# EAGLE design Uno (EAGLE 6.5.0)
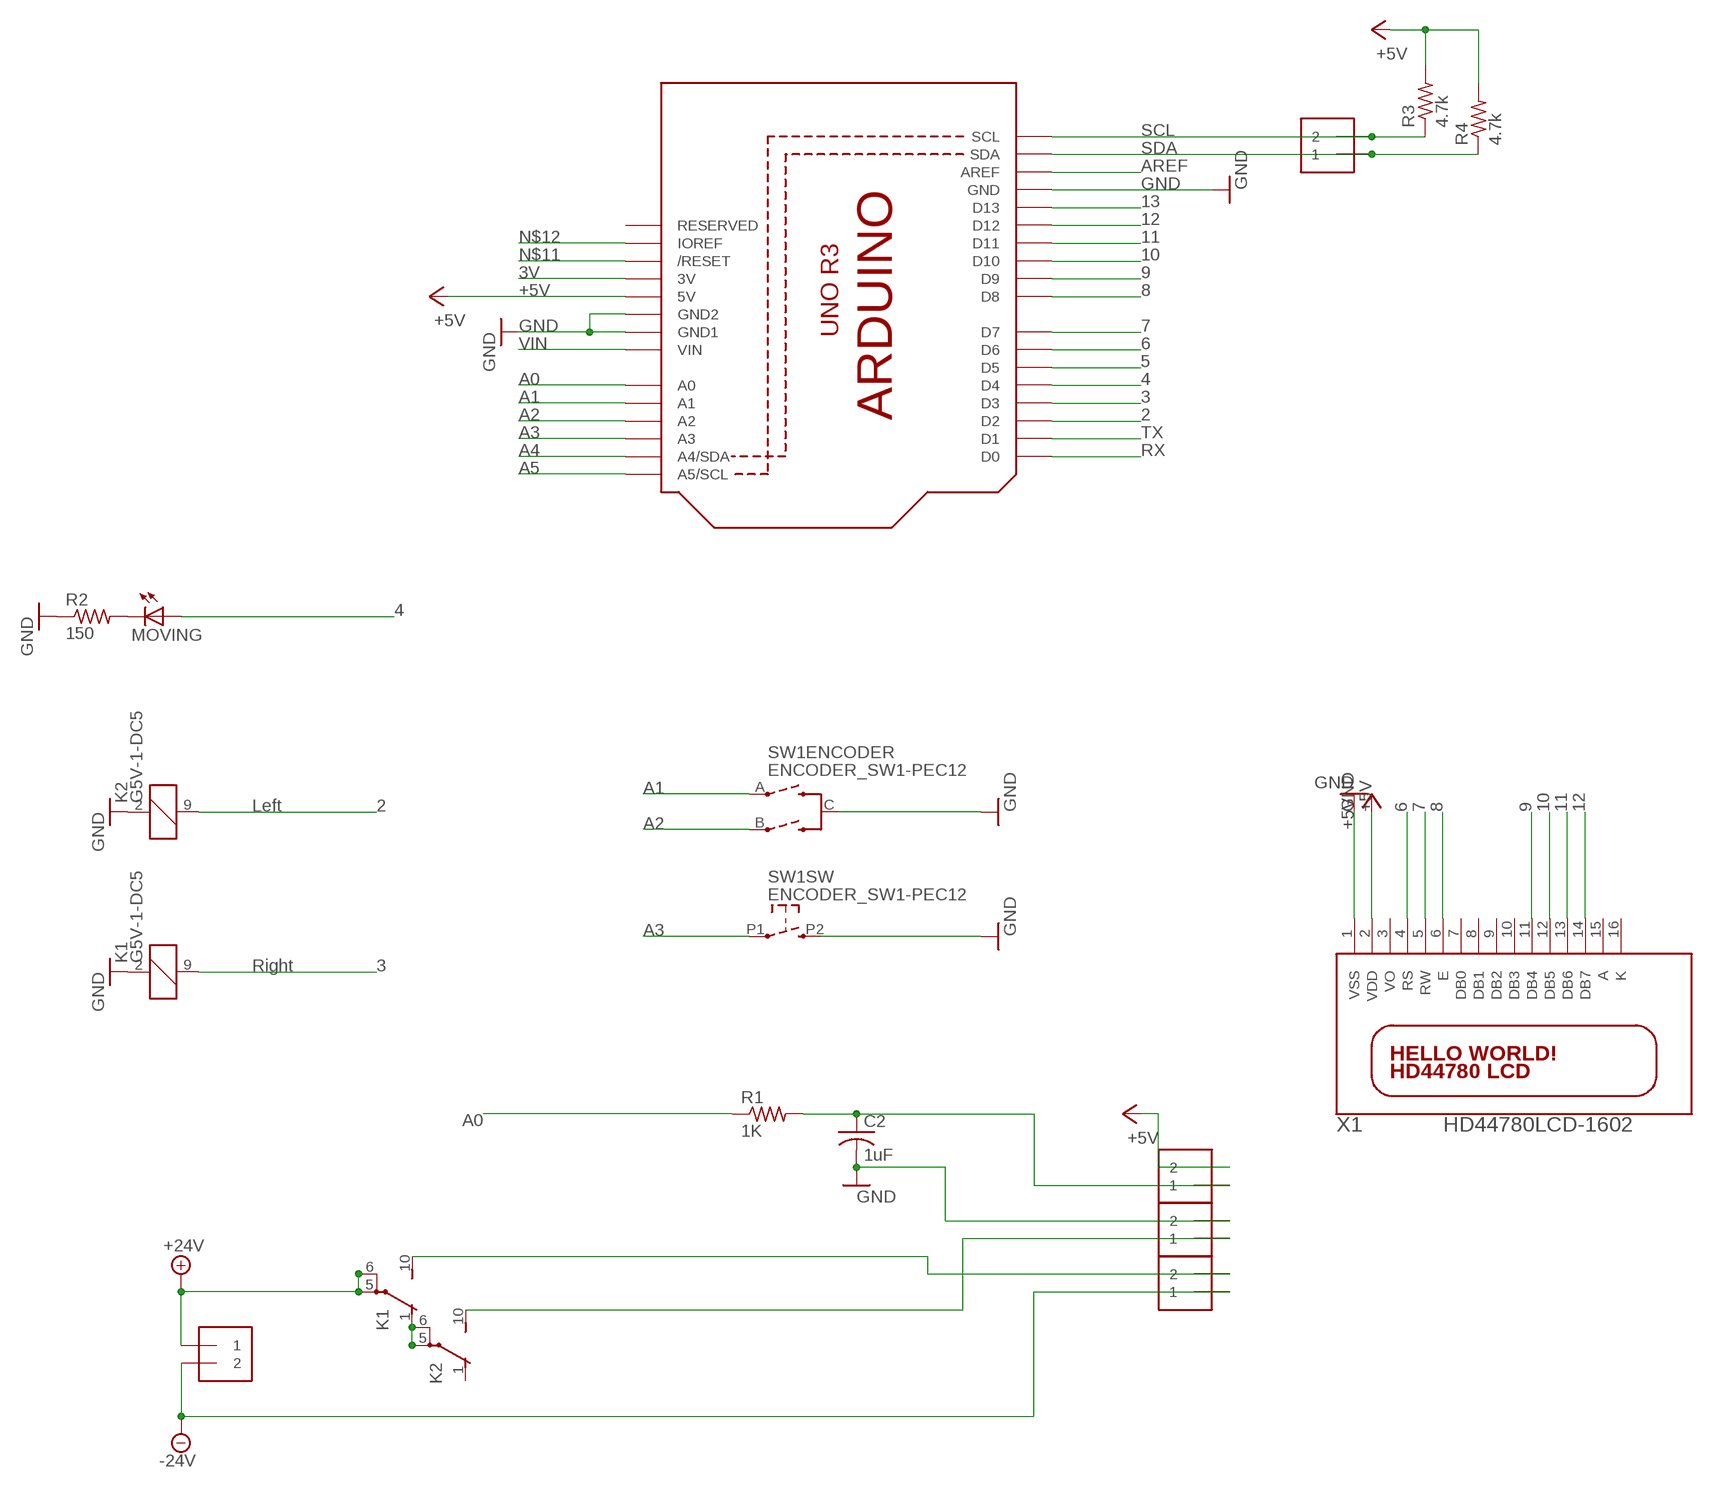
[diagram p0: schematic, sheet 1]

## Parts
C2  1uF  C-US050-024X044  [C050-024X044]
J1  1X2-3.5MM  [1X2-3.5MM]
J2  1X2-3.5MM  [1X2-3.5MM]
J3  1X2-3.5MM  [1X2-3.5MM]
J4  1X2-3.5MM  [1X2-3.5MM]
J5  1X2-3.5MM  [1X2-3.5MM]
K1  G5V-1-DC5  G5V1  [G5V1]
K2  G5V-1-DC5  G5V1  [G5V1]
MOVING  LED5MM  [LED5MM]
R1  1K  R-US_0414/5V  [0414V]
R2  150  R-US_0207/5V  [0207/5V]
R3  4.7k  R-US_0207/5V  [0207/5V]
R4  4.7k  R-US_0207/5V  [0207/5V]
SW1  ENCODER_SW1-PEC12  [PEC12_INCREMENTAL_ENCODER]
U1  ARDUINOR3-BPLACE  [ARDUINOR3-BPLACE]
X1  HD44780LCD-1602  [LCD1602]

## Nets
2: K2.9 U1.D2
3: K1.9 U1.D3
3V: U1.3V
4: MOVING.A U1.D4
5: U1.D5
6: U1.D6 X1.4(RS)
7: U1.D7 X1.5(RW)
8: U1.D8 X1.6(E)
9: U1.D9 X1.11(DB4)
10: U1.D10 X1.12(DB5)
11: U1.D11 X1.13(DB6)
12: U1.D12 X1.14(DB7)
13: U1.D13
+5V [Power]: J5.2 R3.2 R4.2 U1.5V X1.2(VDD)
+24V [Power]: J2.1 K1.5(2:P) K1.6(2:P)
-24V [Power]: J2.2 J3.1
A0: R1.1 U1.A0
A1: SW1.A(ENCODER:A) U1.A1
A2: SW1.B(ENCODER:B) U1.A2
A3: SW1.P1 U1.A3
A4: U1.A4(A4/SDA)
A5: U1.A5(A5/SCL)
AREF: U1.AREF
GND [Power]: C2.2 J4.2 K1.2 K2.2 R2.1 SW1.C(ENCODER:C) SW1.P2 U1.GND U1.GND1 U1.GND2 X1.1(VSS)
N$1: MOVING.K(C) R2.2
N$2 [Power]: K1.1(2:O) K2.5(2:P) K2.6(2:P)
N$3 [Power]: J3.2 K1.10(2:S)
N$5 [Power]: J4.1 K2.10(2:S)
N$8: C2.1 J5.1 R1.2
N$11: U1.RESET(/RESET)
N$12: U1.IOREF
RX: U1.D0
SCL: J1.2 R3.1 U1.SCL
SDA: J1.1 R4.1 U1.SDA
TX: U1.D1
VIN: U1.VIN
Unconnected: K2.1(2:O) U1.RESERVED X1.3(VO) X1.7(DB0) X1.8(DB1) X1.9(DB2) X1.10(DB3) X1.15(A) X1.16(K)

## Notes on the sheet
- Left
- Right

## Library data of the parts
C2 = adafruit:C-US: CAPACITOR, American symbol
J1-J5 = adafruit:1X2: 3.5mm Terminal block http://www.ladyada.net/library/pcb/eaglelibrary.html
K1 K2 = relay:G5V1: RELAY 1 x switch, 0.5 A/125 V AC, 1 A/24 V DC , Omron; MPN: G5V-1-DC24; OC_FARNELL: 9949593; OC_NEWARK: 36M6377
MOVING = adafruit:LED: LED OSRAM: - CHIPLED LG R971, LG N971, LY N971, LG Q971, LY Q971, LO R971, LY R971 LH N974, LH R974 LS Q976, LO Q976, LY Q976 LO Q996 - Hyper CHIPLED LW Q18S LB Q993, LB Q99A, LB R99A - SideLED LS A670, LO A670, LY A670, LG A670, LP A670 LB A673, LV A673, LT A673, LW A673 LH A674 LY A675 LS A676, LA A676, LO A676, LY A676, LW A676 LS A679, LY A679, LG A679 - Hyper Micro SIDELED® LS Y876, LA Y876, LO Y876, LY Y876 LT Y87S - SmartLED LW L88C, LW L88S LB L89C, LB L89S, LG L890 LS L89K, LO L89K, LY L89K LS L896, LA L896, LO L896, LY L896 - TOPLED LS T670, LO T670, LY T670, LG T670, LP T670 LSG T670, LSP T670, LSY T670, LOP T670, LYG T670 LG T671, LOG T671, LSG T671 LB T673, LV T673, LT T673, LW T673 LH T674 LS T676, LA T676, LO T676, LY T676, LB T676, LH T676, LSB T676, LW T676 LB T67C, LV T67C, LT T67C, LS T67K, LO T67K, LY T67K, LW E67C LS E67B, LA E67B, LO E67B, LY E67B, LB E67C, LV E67C, LT E67C LW T67C LS T679, LY T679, LG T679 LS T770, LO T770, LY T770, LG T770, LP T770 LB T773, LV T773, LT T773, LW T773 LH T774 LS E675, LA E675, LY E675, LS T675 LS T776, LA T776, LO T776, LY T776, LB T776 LHGB T686 LT T68C, LB T68C - Hyper Mini TOPLED® LB M676 - Mini TOPLED Santana® LG M470 LS M47K, LO M47K, LY M47K Source: http://www.osram.convergy.de/
R1-R4 = adafruit:R-US_: RESISTOR, American symbol
SW1 = dp_devices:ENCODER_SW1: Incremental Encoder with push switch
U1 = adafruitedit:ARDUINOR3: This is a new object for the new Arduino R3 - with extra pins that you may want to use (such as IOref, and duplicated A4/A5
X1 = adafruitedit:HD44780LCD: HD44780 LCD Standard character type LCDs, available in sizes from 8x1 to 40x4!

## Net classes
0 default: width 0.203 mm, drill 0.33 mm, clearance 0.152 mm
2 Power: width 0.61 mm, drill 0.33 mm, clearance 0.152 mm
4 24V Power: width 1.016 mm, drill 0.33 mm, clearance 0.305 mm

## Board
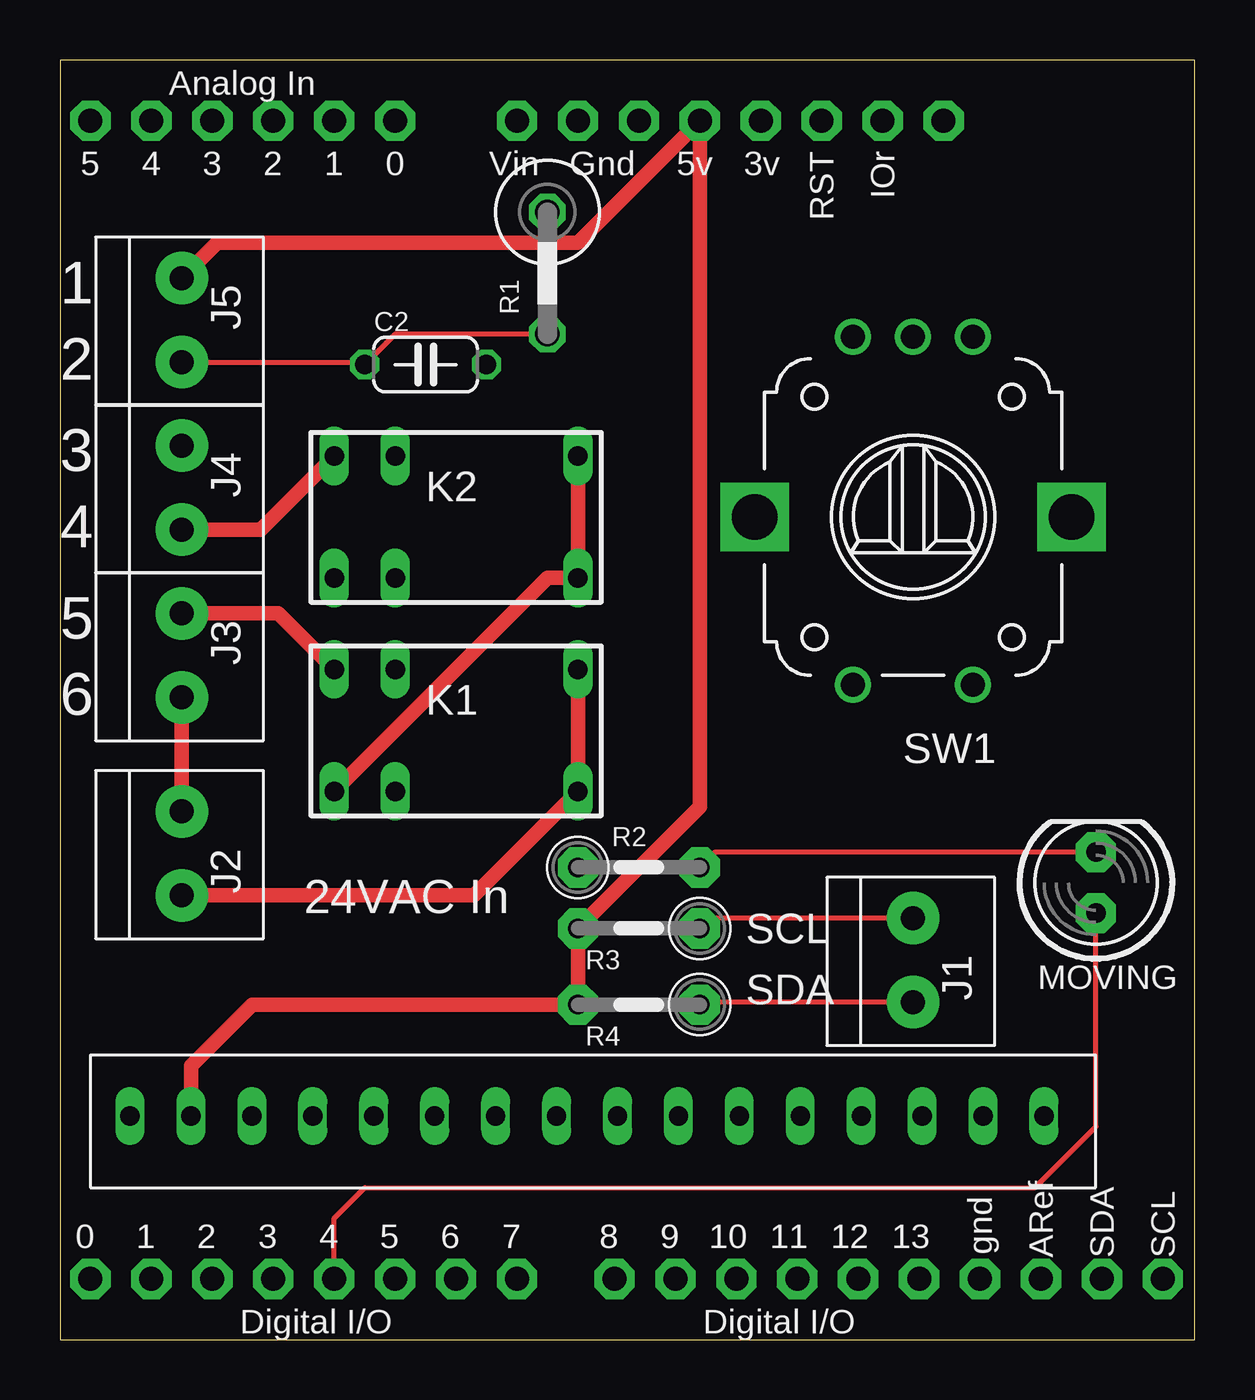
[diagram p1: board, top side]
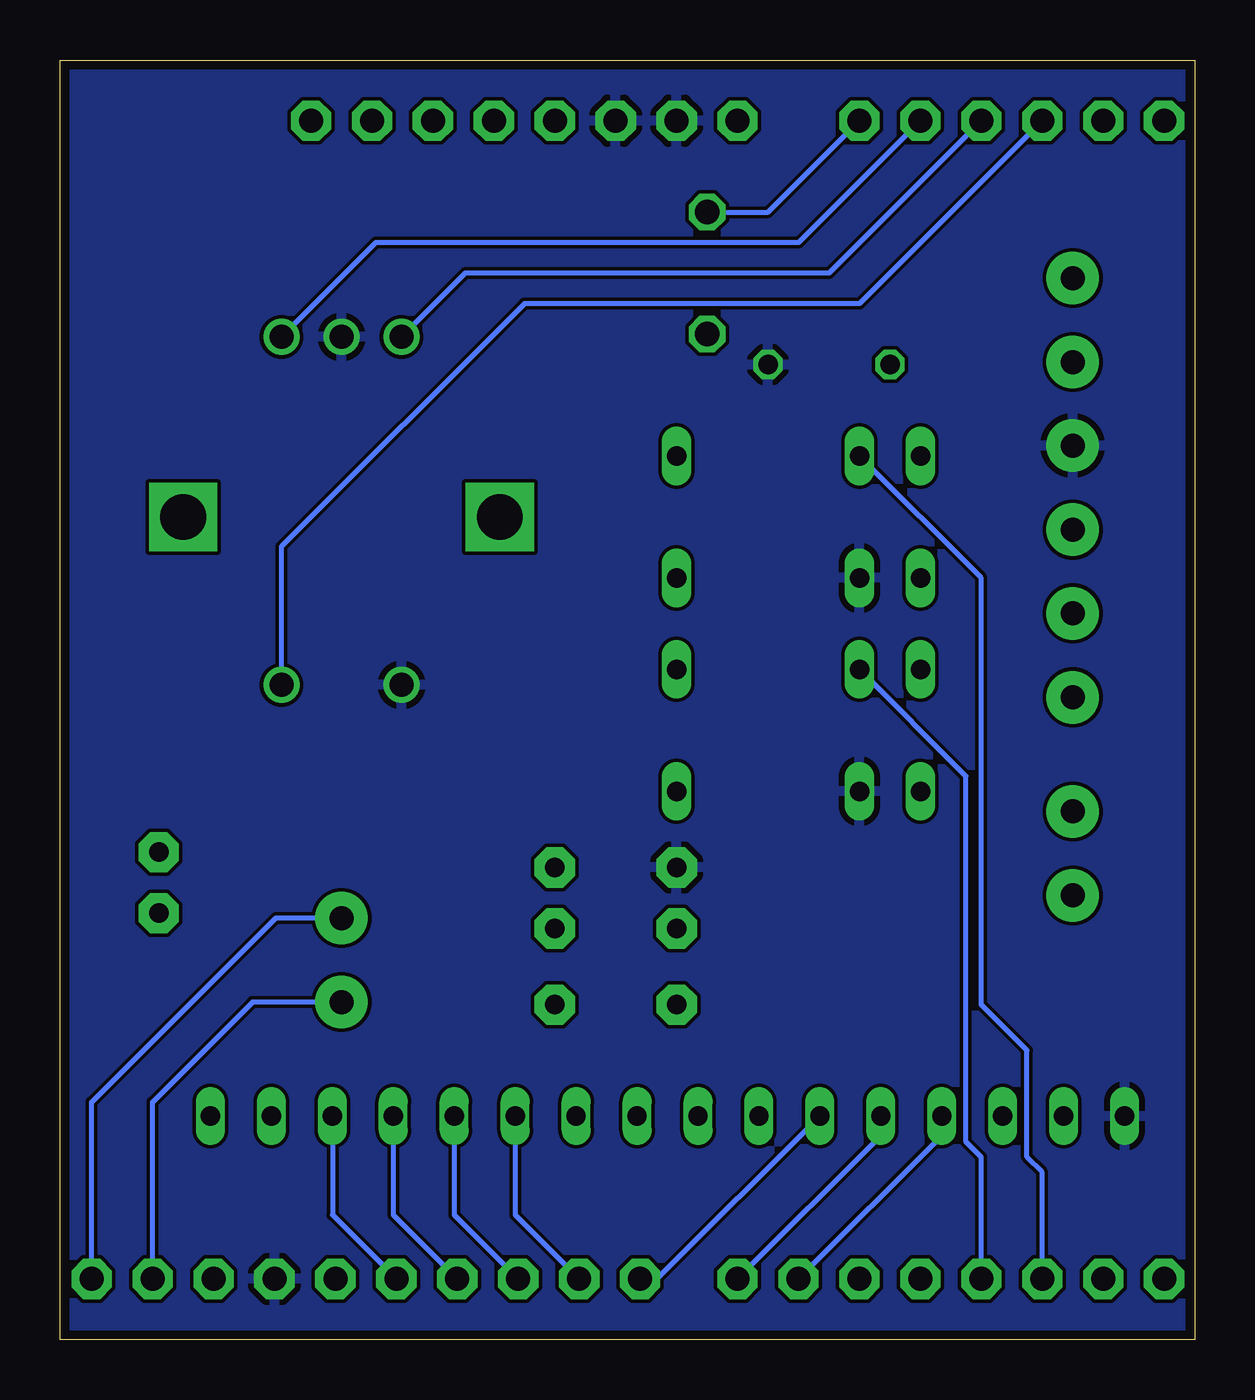
[diagram p2: board, bottom side, seen from below]

Size 47.3 x 53.33 mm. Coordinates in mm from the lower left corner, seen from the top.
Outline: 0,0 47.3,0 47.3,53.33 0,53.33 0,0
Copper layers (1*16): Top 0.0356mm / dielectric 1.5011mm / Bottom 0.0356mm
Design rules "LaenPCBOrder": minimum track width 6mil, minimum drill 13mil, track to track 6mil, track to pad 6mil, pad to pad 6mil, via to via 6mil, smd to smd 6mil, copper to edge 15mil, drill to drill 6mil, minimum pad ring 7mil, minimum via ring 7mil, stop-mask expansion 4mil, vias tented up to drill 0mil, thermal gap 10mil

### Footprints (pad centres in the part's own frame; a part is rotated, then mirrored left to right if it is on the bottom)
C050-024X044 = drill 0.813 octagon: 1 -2.54,0; 2 2.54,0
1X2-3.5MM = drill 1 pad 2.184: 1 1.8,0; 2 -1.7,0
G5V1 = drill 0.813 long: 1 -5.08,-2.54; 2 -2.54,-2.54; 5 5.08,-2.54; 6 5.08,2.54; 9 -2.54,2.54; 10 -5.08,2.54
LED5MM = drill 0.813 pad 1.676 octagon: A -1.27,0; K 1.27,0
0414V = drill 1.016 octagon: 1 -2.54,0; 2 2.54,0
0207/5V = drill 0.813 pad 1.676 octagon: 1 -2.54,0; 2 2.54,0
PEC12_INCREMENTAL_ENCODER = drill 1: A -2.5,-7.5; B 2.5,-7.5; C 0,-7.5; P1 -2.5,7; P2 2.5,7 | drill 1.9 square: GND@1 -6.6,0; GND@2 6.6,0
ARDUINOR3-BPLACE = drill 1 pad 1.676 octagon: 3V 35.56,2.54; 5V 38.1,2.54; A0 50.8,2.54; A1 53.34,2.54; A2 55.88,2.54; A3 58.42,2.54; A4 60.96,2.54; A5 63.5,2.54; AREF 23.876,50.8; D0 63.5,50.8; D1 60.96,50.8; D2 58.42,50.8; D3 55.88,50.8; D4 53.34,50.8; D5 50.8,50.8; D6 48.26,50.8; D7 45.72,50.8; D8 41.656,50.8; D9 39.116,50.8; D10 36.576,50.8; D11 34.036,50.8; D12 31.496,50.8; D13 28.956,50.8; GND 26.416,50.8; GND1 43.18,2.54; GND2 40.64,2.54; IOREF 30.48,2.54; RESERVED 27.94,2.54; RESET 33.02,2.54; SCL 18.796,50.8; SDA 21.336,50.8; VIN 45.72,2.54
LCD1602 = drill 0.8 long: 1 1.65,2.98; 2 4.19,2.98; 3 6.73,2.98; 4 9.27,2.98; 5 11.81,2.98; 6 14.35,2.98; 7 16.89,2.98; 8 19.43,2.98; 9 21.97,2.98; 10 24.51,2.98; 11 27.05,2.98; 12 29.59,2.98; 13 32.13,2.98; 14 34.67,2.98; 15 37.21,2.98; 16 39.75,2.98

### Placement (x,y rotation side)
C2  15.24,40.64 0 top
J1  35.56,15.88 270 top
J2  5.08,20.32 270 top
J3  5.08,28.57 270 top
J4  5.08,35.56 270 top
J5  5.08,42.55 270 top
K1  16.51,25.4 0 top
K2  16.51,34.29 0 top
MOVING  43.18,19.05 90 top
R1  20.32,44.45 270 top
R2  24.13,19.68 0 top
R3  24.13,17.14 180 top
R4  24.13,13.97 180 top
SW1  35.56,34.29 180 top
U1  64.77,53.34 180 top
X1  1.27,6.35 0 top

### Tracks (layer width: path | path; a pad name or v marks a point on that pad's centre or on a via)
2
  Bottom 0.203: U1.D2 6.35,6.98 6.99,7.62 6.99,12.06 8.89,13.97 8.89,31.75 K2.9
3
  Bottom 0.203: U1.D3 8.89,7.62 9.53,8.26 9.53,23.5 K1.9
4
  Top 0.203: U1.D4 11.43,5.08 12.7,6.35 40.64,6.35 43.18,8.89 MOVING.A
6
  Bottom 0.203: X1.4 10.54,8.51 U1.D6
7
  Bottom 0.203: X1.5 13.08,8.51 U1.D7
8
  Bottom 0.203: U1.D8 22.41,2.54 X1.6
9
  Bottom 0.203: X1.11 28.32,5.21 U1.D9
10
  Bottom 0.203: X1.12 30.86,5.21 U1.D10
11
  Bottom 0.203: X1.13 33.4,5.21 U1.D11
12
  Bottom 0.203: X1.14 35.94,5.21 U1.D12
+5V
  Top 0.61: J5.2 6.55,45.72 21.59,45.72 U1.5V 26.67,22.22 R3.2 R4.2 8,13.97 5.46,11.43 X1.2
+24V
  Top 0.61: J2.1 17.25,18.52 K1.5 K1.6
-24V
  Top 0.61: J2.2 J3.1
A0
  Bottom 0.203: U1.A0 17.78,46.99 R1.1
A1
  Bottom 0.203: U1.A1 16.51,45.72 34.13,45.72 SW1.A
A2
  Bottom 0.203: U1.A2 15.24,44.45 30.4,44.45 SW1.B
A3
  Bottom 0.203: U1.A3 13.97,43.18 27.94,43.18 38.06,33.06 SW1.P1
GND
  pour Bottom: 0,53.34 46.99,53.34 46.99,0 0,0
N$1
  Top 0.203: MOVING.K 27.3,20.32 R2.2
N$2
  Top 0.61: K1.1 20.32,31.75 K2.5 K2.6
N$3
  Top 0.61: J3.2 9.1,30.27 K1.10
N$5
  Top 0.61: J4.1 8.36,33.76 K2.10
N$8
  Top 0.203: R1.2 13.97,41.91 C2.1 12.6,40.75 J5.1
SCL
  Top 0.203: J1.2 27.1,17.57 R3.1
  Bottom 0.203: J1.2 38.3,17.57 45.97,9.91 U1.SCL
SDA
  Top 0.203: J1.1 26.77,14.07 R4.1
  Bottom 0.203: J1.1 39.27,14.07 43.43,9.91 U1.SDA

### Text on the board
_tsilk: 1 | 2 | 3 | 4 | 5 | 6 | 24VAC In | SCL | SDA